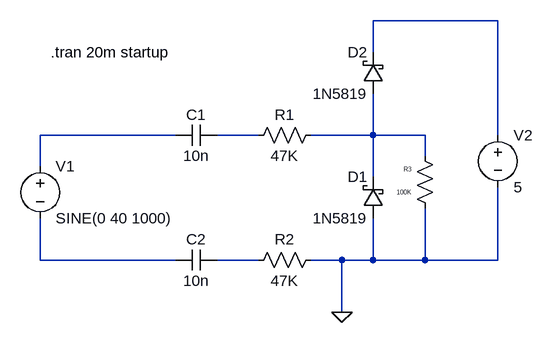
[diagram p0: schematic Draft3.asc]
Draft3.asc, the LTspice schematic file:
Version 4
SHEET 1 880 680
WIRE 576 80 384 80
WIRE 384 128 384 80
WIRE 80 256 -128 256
WIRE 208 256 144 256
WIRE 384 256 384 192
WIRE 384 256 288 256
WIRE 464 256 384 256
WIRE 576 256 576 80
WIRE 464 288 464 256
WIRE -128 304 -128 256
WIRE 384 320 384 256
WIRE -128 448 -128 384
WIRE 80 448 -128 448
WIRE 208 448 144 448
WIRE 336 448 288 448
WIRE 384 448 384 384
WIRE 384 448 336 448
WIRE 464 448 464 368
WIRE 464 448 384 448
WIRE 576 448 576 336
WIRE 576 448 464 448
WIRE 336 528 336 448
FLAG 336 528 0
SYMBOL voltage -128 288 R0
SYMATTR InstName V1
SYMATTR Value SINE(0 40 1000)
SYMBOL cap 144 240 R90
WINDOW 0 0 32 VBottom 2
WINDOW 3 32 32 VTop 2
SYMATTR InstName C1
SYMATTR Value 10n
SYMBOL cap 144 432 R90
WINDOW 0 0 32 VBottom 2
WINDOW 3 32 32 VTop 2
SYMATTR InstName C2
SYMATTR Value 10n
SYMBOL res 304 240 R90
WINDOW 0 0 56 VBottom 2
WINDOW 3 32 56 VTop 2
SYMATTR InstName R1
SYMATTR Value 47K
SYMBOL res 304 432 R90
WINDOW 0 0 56 VBottom 2
WINDOW 3 32 56 VTop 2
SYMATTR InstName R2
SYMATTR Value 47K
SYMBOL schottky 400 384 R180
WINDOW 0 24 64 Left 2
WINDOW 3 24 0 Left 2
SYMATTR InstName D1
SYMATTR Value 1N5819
SYMATTR Description Diode
SYMATTR Type diode
SYMBOL schottky 400 192 R180
WINDOW 0 24 64 Left 2
WINDOW 3 24 0 Left 2
SYMATTR InstName D2
SYMATTR Value 1N5819
SYMATTR Description Diode
SYMATTR Type diode
SYMBOL voltage 576 240 R0
SYMATTR InstName V2
SYMATTR Value 5
SYMATTR SpiceLine Rser=10
SYMBOL res 480 384 R180
WINDOW 0 36 76 Left 0
WINDOW 3 36 40 Left 0
SYMATTR InstName R3
SYMATTR Value 100K
TEXT -112 128 Left 2 !.tran 20m startup

The netlist it stands for:
* Draft3.asc
V1 N002 N005 SINE(0 40 1000)
C1 N003 N002 10n
C2 N006 N005 10n
R1 N004 N003 47K
R2 0 N006 47K
D1 0 N004 1N5819
D2 N004 N001 1N5819
V2 N001 0 5 Rser=10
R3 0 N004 100K
.model D D
.lib standard.dio
.tran 20m startup
.backanno
.end